# Altium schematic sheet UD3c bootstrap output.SchDoc
size A
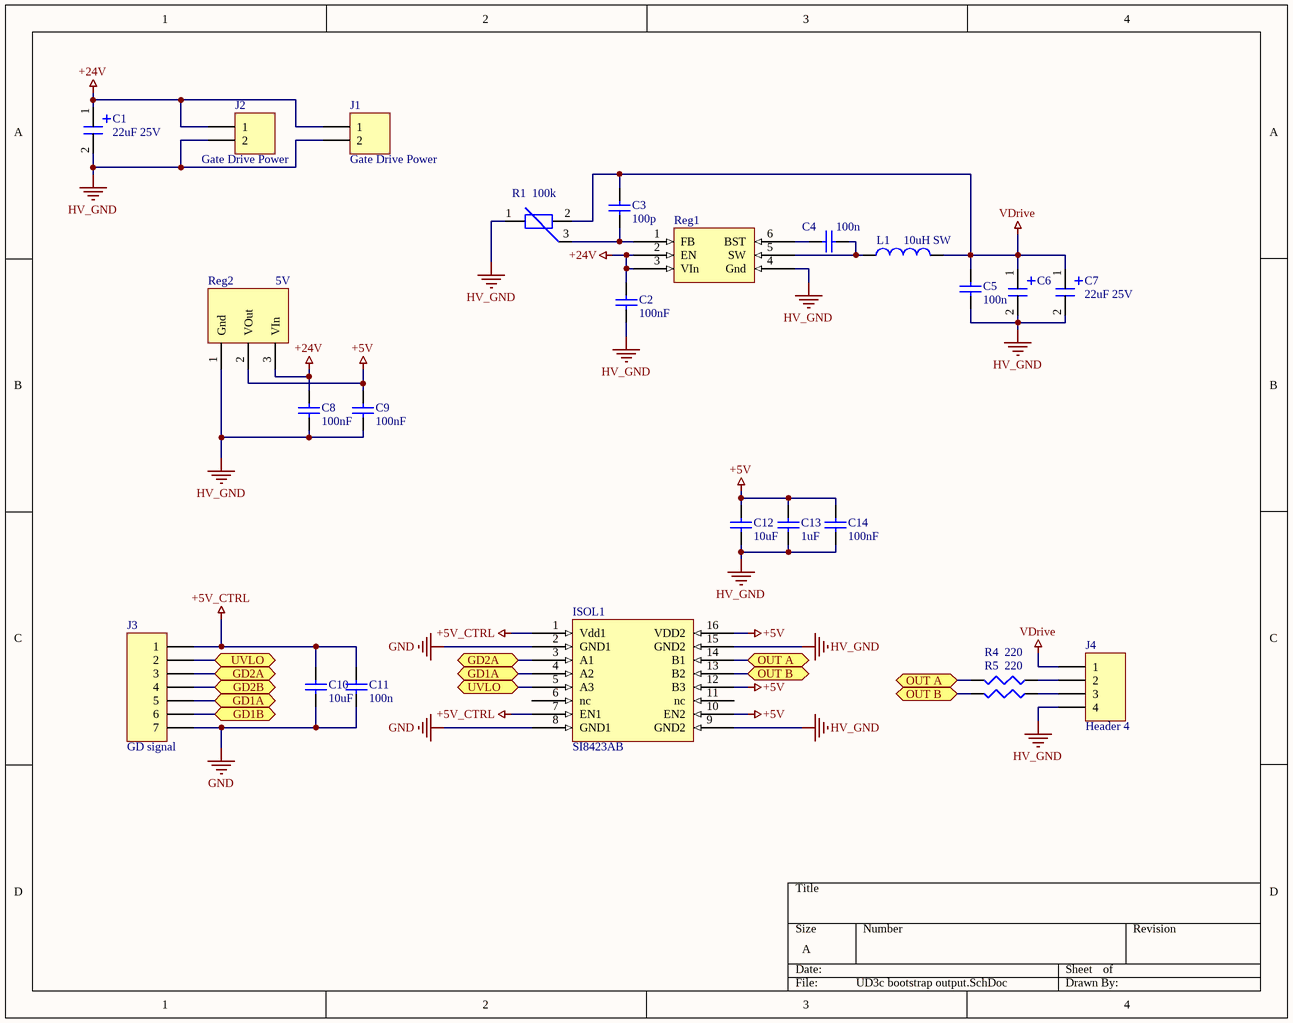
[diagram p0: UD3c bootstrap output.SchDoc]

## Parts
C1  22uF 25V  [2917 Tantalum]
C2  100nF  [0603]
C3  100p  [0603]
C4  100n  [0603]
C5  100n  [0603]
C6  22uF 25V  [2917 Tantalum]  (value not drawn)
C7  22uF 25V  [2917 Tantalum]
C8  100nF  [0603]
C9  100nF  [0603]
C10  10uF  [0603]
C11  100n  [0603]
C12  10uF  [0603]
C13  1uF  [0603]
C14  100nF  [0603]
ISOL1  SI8423AB  [SOIC16 WIDE Isol]
J1  Gate Drive Power  [HDR1X2]
J2  Gate Drive Power  [HDR1X2]
J3  GD signal  [HDR1X7]
J4  Header 4  [HDR1X4]
L1  10uH SW  [1008]
R1  100k  [Trimmer vert]
R4  220  [0603]
R5  220  [0603]
Reg1  Buck regulator  [TSOT26]  (value not drawn)
Reg2  5V  [SOT223]

## Ports
GD1A (bidir), GD1B (bidir), GD2A (bidir), GD2B (bidir), OUT A (bidir), OUT B (bidir), UVLO (bidir)

## Nets
+5V: C9.2 C12.2 C13.2 C14.2 ISOL1.10(EN2) ISOL1.12(B3) ISOL1.16(VDD2) Reg2.2(VOut)
+5V_CTRL: C10.1 C11.1 ISOL1.1(Vdd1) ISOL1.7(EN1) J3.1
+24V: C1.1 C2.2 C8.2 J1.1 J2.1 Reg1.2(EN) Reg1.3(VIn) Reg2.3(VIn)
GND: C10.2 C11.2 ISOL1.2(GND1) ISOL1.8(GND1) J3.7
HV_GND: C1.2 C2.1 C5.2 C6.2 C7.2 C8.1 C9.1 C12.1 C13.1 C14.1 ISOL1.9(GND2) ISOL1.15(GND2) J1.2 J2.2 J4.4 R1.1 Reg1.4(Gnd) Reg2.1(Gnd)
VDrive: C3.2 C5.1 C6.1 C7.1 J4.1 L1.2 R1.2
GD1A: ISOL1.4(A2) J3.5 ; port GD1A
GD1B: J3.6 ; port GD1B
GD2A: ISOL1.3(A1) J3.3 ; port GD2A
GD2B: J3.4 ; port GD2B
OUT A: ISOL1.14(B1) R4.2 ; port OUT A
OUT B: ISOL1.13(B2) R5.2 ; port OUT B
UVLO: ISOL1.5(A3) J3.2 ; port UVLO
NetC3_1: C3.1 R1.3 Reg1.1(FB)
NetC4_1: C4.1 Reg1.6(BST)
NetC4_2: C4.2 L1.1 Reg1.5(SW)
NetJ4_2: J4.2 R4.1
NetJ4_3: J4.3 R5.1

Not connected (* = marked no-connect by the designer): ISOL1 6(nc) 11(nc)

## Library data of the parts
C1 C6 C7 = Cap Polar: Supplier 1: Digi-Key; Supplier Part Number 1: 478-9181-1-ND; Supplier 2: Digi-Key; Supplier 3: Digi-Key; Supplier Part Number 2: 478-9173-1-ND; Supplier Part Number 3: 493-11037-ND; Supplier 4: Digi-Key; Supplier 5: Digi-Key; Supplier Part Number 4: PCE3462CT-ND; Supplier Part Number 5: 399-18864-1-ND; Supplier 6: Digi-Key; Supplier Part Number 6: 399-10512-1-ND
C2-C5 C8-C14 = Cap: Supplier 1: Digi-Key; Supplier 2: Digi-Key; Supplier 3: Digi-Key; Supplier Part Number 1: 1276-2044-1-ND; Supplier Part Number 2: 1276-1018-1-ND; Supplier Part Number 3: 1276-1182-1-ND; Supplier 4: Digi-Key; Supplier 5: Digi-Key; Supplier 6: Digi-Key; Supplier 7: Digi-Key; Supplier 8: Digi-Key; Supplier 9: Digi-Key; Supplier Part Number 4: 1276-1009-1-ND; Supplier Part Number 5: 1276-1098-1-ND; Supplier Part Number 6: 1276-1119-1-ND; Supplier Part Number 7: 490-12737-1-ND; Supplier Part Number 9: 587-1249-1-ND; Supplier Part Number 8: 1276-1183-1-ND; Supplier 10: Digi-Key; Supplier 11: Digi-Key; Supplier 12: Digi-Key; Supplier 13: Digi-Key; Supplier Part Number 10: 1276-CL10B104KB8NNNLCT-ND; Supplier Part Number 11: 399-1085-1-ND; Supplier Part Number 12: 1276-1021-1-ND; Supplier Part Number 13: 587-2985-1-ND
  C3-C5 C10 C11: Supplier 14: Digi-Key; Supplier 15: Digi-Key; Supplier 16: Digi-Key; Supplier 17: Digi-Key; Supplier 18: Digi-Key; Supplier 19: Digi-Key; Supplier Part Number 14: 490-14603-1-ND; Supplier Part Number 15: 311-3700-1-ND; Supplier Part Number 16: 311-1042-1-ND; Supplier Part Number 17: 311-1415-1-ND; Supplier Part Number 19: 587-4321-1-ND; Supplier Part Number 18: 1276-1907-1-ND; Supplier 20: Digi-Key; Supplier 21: Digi-Key; Supplier 22: Digi-Key; Supplier Part Number 20: 1276-6767-1-ND; Supplier Part Number 21: 1276-7060-1-ND; Supplier Part Number 22: 311-1084-1-ND
ISOL1 = SI8423AB: Three (2/1) channel isolator; Supplier 1: Digi-Key; Supplier Part Number 1: SI8631AB-B-IS1-ND
J1 J2 = Header 2: Header, 2-Pin; LatestRevisionDate: 17-Jul-2002; LatestRevisionNote: Re-released for DXP Platform.; Publisher: Altium Limited
J3 = Header 7: Header, 7-Pin; LatestRevisionDate: 17-Jul-2002; LatestRevisionNote: Re-released for DXP Platform.; Publisher: Altium Limited
J4 = Header 4: Header, 4-Pin; LatestRevisionDate: 17-Jul-2002; LatestRevisionNote: Re-released for DXP Platform.; Publisher: Altium Limited
L1 = Inductor: Supplier 1: Digi-Key; Supplier 2: Digi-Key; Supplier Part Number 1: 541-1250-1-ND; Supplier Part Number 2: 541-1253-1-ND; Supplier 3: Digi-Key; Supplier 4: Digi-Key; Supplier Part Number 3: SRN6028-3R9MCT-ND; Supplier Part Number 4: SRN6028-4R7MCT-ND; Supplier 5: Digi-Key; Supplier 6: Digi-Key; Supplier 7: Digi-Key; Supplier 8: Digi-Key; Supplier 9: Digi-Key; Supplier 10: Digi-Key; Supplier 11: Digi-Key; Supplier Part Number 5: 490-10563-1-ND; Supplier Part Number 6: 1276-6932-1-ND; Supplier Part Number 7: 587-2042-1-ND; Supplier Part Number 8: 535-12790-1-ND; Supplier Part Number 9: SRP1265A-1R0MCT-ND; Supplier Part Number 10: SRP1770TA-5R6MCT-ND; Supplier Part Number 11: SRN6028-100MCT-ND
R1 = Trimmer
R4 R5 = Resistor: Supplier 1: Digi-Key; Supplier 2: Digi-Key; Supplier Part Number 1: RHM10DCT-ND; Supplier Part Number 2: 696-1834-1-ND; Supplier 3: Digi-Key; Supplier 4: Digi-Key; Supplier 5: Digi-Key; Supplier 6: Digi-Key; Supplier 7: Digi-Key; Supplier Part Number 3: RMCF0603JT3K90CT-ND; Supplier Part Number 5: RHM100DCT-ND; Supplier Part Number 6: RMCF0603FT54K9CT-ND; Supplier Part Number 7: RMCF0603FT40K2CT-ND; Supplier Part Number 4: RHM1.0KDCT-ND; Supplier 8: Digi-Key; Supplier 9: Digi-Key; Supplier 10: Digi-Key; Supplier 11: Digi-Key; Supplier Part Number 10: 311-200JRCT-ND; Supplier Part Number 11: 311-300JRCT-ND; Supplier Part Number 8: P200LCT-ND; Supplier Part Number 9: 311-1.0KJRCT-ND; Supplier 12: Digi-Key; Supplier 13: Digi-Key; Supplier 14: Digi-Key; Supplier 15: Digi-Key; Supplier 16: Digi-Key; Supplier 17: Digi-Key; Supplier Part Number 12: YAG3356CT-ND; Supplier Part Number 13: 311-220GRCT-ND; Supplier Part Number 14: 311-220KGRCT-ND; Supplier Part Number 15: 311-1.0KGRCT-ND; Supplier Part Number 16: 311-200KHRCT-ND; Supplier Part Number 17: A102451-ND; Supplier 18: Digi-Key; Supplier Part Number 18: 311-2.00KHRCT-ND; Supplier 19: Digi-Key; Supplier Part Number 19: 311-10KGRCT-ND; Supplier 20: Digi-Key; Supplier 21: Digi-Key; Supplier 22: Digi-Key; Supplier 23: Digi-Key; Supplier 24: Digi-Key; Supplier 25: Digi-Key; Supplier 26: Digi-Key; Supplier 27: Digi-Key; Supplier 28: Digi-Key; Supplier 29: Digi-Key; Supplier Part Number 29: 311-499KLRCT-ND; Supplier Part Number 28: 311-200KJRCT-ND; Supplier Part Number 26: YAG3226CT-ND; Supplier Part Number 20: 311-1.00LRCT-ND; Supplier Part Number 25: 311-12KJRCT-ND; Supplier Part Number 24: 311-10.0KLRCT-ND; Supplier Part Number 23: 311-4.7KJRCT-ND; Supplier Part Number 22: 311-2.2KJRCT-ND; Supplier Part Number 21: 311-220JRCT-ND; Supplier Part Number 27: 311-75KJRCT-ND; Supplier 30: Digi-Key; Supplier 31: Digi-Key; Supplier 32: Digi-Key; Supplier Part Number 30: YAG6087CT-ND; Supplier Part Number 31: 696-1677-1-ND; Supplier Part Number 32: 541-3127-6-ND; Supplier 33: Digi-Key; Supplier 34: Digi-Key; Supplier 35: Digi-Key; Supplier 36: Digi-Key; Supplier 37: Digi-Key; Supplier 38: Digi-Key; Supplier 39: Digi-Key; Supplier 40: Digi-Key; Supplier 41: Digi-Key; Supplier 42: Arrow; Supplier Part Number 33: 311-47.0HRCT-ND; Supplier Part Number 34: 311-470HRCT-ND; Supplier Part Number 35: 311-470KGRCT-ND; Supplier Part Number 36: 311-100KGRCT-ND; Supplier Part Number 37: 311-5.23KHRCT-ND; Supplier Part Number 38: 311-52.3KHRCT-ND; Supplier Part Number 39: 311-22KGRCT-ND; Supplier Part Number 40: 311-15.8KHRCT-ND; Supplier Part Number 41: 311-7.15KHRCT-ND; Supplier Part Number 42: RC0603FR-072K2L
Reg1 = AP6320: Supplier 1: Digi-Key; Supplier Part Number 1: AP63203WU-7DICT-ND; Supplier 2: Digi-Key; Supplier Part Number 2: AP63200WU-7DICT-ND; Supplier 3: Digi-Key; Supplier Part Number 3: AP63201WU-7DICT-ND
Reg2 = VReg